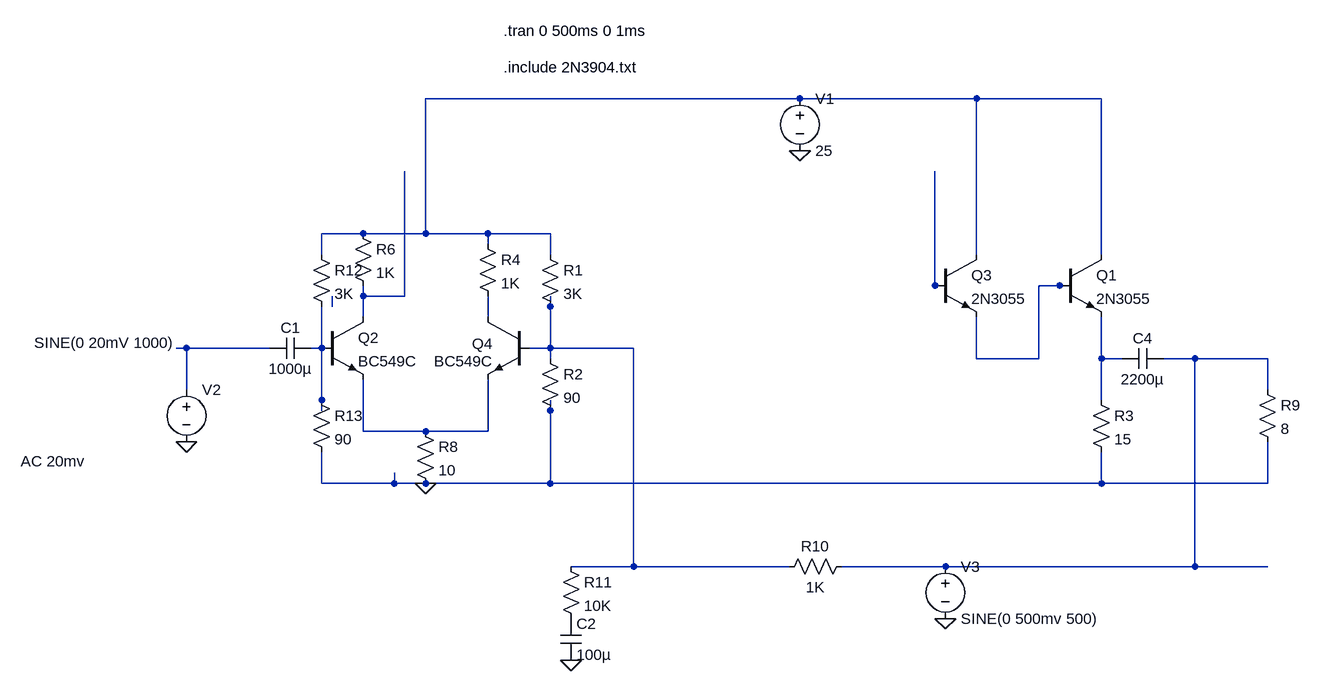
[diagram p0: schematic Long tailed with 2N3904 and cascaded common collectors - noise is completely removed.asc]
Long tailed with 2N3904 and cascaded common collectors - noise is completely removed.asc, the LTspice schematic file:
Version 4
SHEET 1 1032 680
WIRE -4896 -3424 -5472 -3424
WIRE -4624 -3424 -4896 -3424
WIRE -4432 -3424 -4624 -3424
WIRE -5568 -3216 -5632 -3216
WIRE -5472 -3216 -5472 -3424
WIRE -5472 -3216 -5568 -3216
WIRE -5376 -3216 -5472 -3216
WIRE -5280 -3216 -5376 -3216
WIRE -5376 -3200 -5376 -3216
WIRE -5632 -3184 -5632 -3216
WIRE -5280 -3184 -5280 -3216
WIRE -4624 -3184 -4624 -3424
WIRE -4432 -3184 -4432 -3424
WIRE -4688 -3136 -4688 -3312
WIRE -4672 -3136 -4688 -3136
WIRE -4496 -3136 -4528 -3136
WIRE -4480 -3136 -4496 -3136
WIRE -5568 -3120 -5568 -3136
WIRE -5504 -3120 -5504 -3312
WIRE -5504 -3120 -5568 -3120
WIRE -5616 -3104 -5616 -3120
WIRE -5280 -3104 -5280 -3120
WIRE -5568 -3088 -5568 -3120
WIRE -5376 -3088 -5376 -3120
WIRE -5840 -3040 -5856 -3040
WIRE -5712 -3040 -5840 -3040
WIRE -5632 -3040 -5632 -3104
WIRE -5632 -3040 -5648 -3040
WIRE -5280 -3040 -5280 -3104
WIRE -5280 -3040 -5312 -3040
WIRE -5152 -3040 -5280 -3040
WIRE -5280 -3024 -5280 -3040
WIRE -4624 -3024 -4624 -3088
WIRE -4528 -3024 -4528 -3136
WIRE -4528 -3024 -4624 -3024
WIRE -4432 -3024 -4432 -3088
WIRE -4400 -3024 -4432 -3024
WIRE -4288 -3024 -4336 -3024
WIRE -4176 -3024 -4288 -3024
WIRE -5840 -2976 -5840 -3040
WIRE -4176 -2976 -4176 -3024
WIRE -5632 -2960 -5632 -3040
WIRE -4432 -2960 -4432 -3024
WIRE -5632 -2944 -5632 -2960
WIRE -5280 -2944 -5280 -2960
WIRE -5568 -2912 -5568 -2992
WIRE -5472 -2912 -5568 -2912
WIRE -5376 -2912 -5376 -2992
WIRE -5376 -2912 -5472 -2912
WIRE -5632 -2832 -5632 -2880
WIRE -5520 -2832 -5520 -2848
WIRE -5520 -2832 -5632 -2832
WIRE -5472 -2832 -5520 -2832
WIRE -5280 -2832 -5280 -2944
WIRE -5280 -2832 -5472 -2832
WIRE -4432 -2832 -4432 -2880
WIRE -4432 -2832 -5280 -2832
WIRE -4176 -2832 -4176 -2896
WIRE -4176 -2832 -4432 -2832
WIRE -5152 -2704 -5152 -3040
WIRE -5152 -2704 -5248 -2704
WIRE -4912 -2704 -5152 -2704
WIRE -4672 -2704 -4832 -2704
WIRE -4288 -2704 -4288 -3024
WIRE -4288 -2704 -4672 -2704
WIRE -4176 -2704 -4288 -2704
FLAG -4896 -3344 0
FLAG -5840 -2896 0
FLAG -5472 -2832 0
FLAG -5248 -2560 0
FLAG -4672 -2624 0
SYMBOL voltage -4896 -3440 R0
WINDOW 123 0 0 Left 2
WINDOW 39 0 0 Left 2
SYMATTR InstName V1
SYMATTR Value 25
SYMBOL voltage -5840 -2992 R0
WINDOW 123 -255 126 Left 2
WINDOW 39 0 0 Left 2
WINDOW 3 -234 -56 Left 2
SYMATTR Value2 AC 20mv
SYMATTR Value SINE(0 20mV 1000)
SYMATTR InstName V2
SYMBOL npn2 -4688 -3184 R0
SYMATTR InstName Q3
SYMATTR Value 2N3055
SYMBOL cap -5648 -3056 R90
WINDOW 0 0 32 VBottom 2
WINDOW 3 32 32 VTop 2
SYMATTR InstName C1
SYMATTR Value 1000µ
SYMBOL res -4192 -2992 R0
SYMATTR InstName R9
SYMATTR Value 8
SYMBOL cap -4336 -3040 R90
WINDOW 0 0 32 VBottom 2
WINDOW 3 32 32 VTop 2
SYMATTR InstName C4
SYMATTR Value 2200µ
SYMBOL npn -5632 -3088 R0
SYMATTR InstName Q2
SYMATTR Value BC549C
SYMBOL npn -5312 -3088 M0
WINDOW 0 56 41 Left 2
SYMATTR InstName Q4
SYMATTR Value BC549C
SYMBOL res -5584 -3232 R0
SYMATTR InstName R6
SYMATTR Value 1K
SYMBOL res -5488 -2928 R0
SYMATTR InstName R8
SYMATTR Value 10
SYMBOL res -4816 -2720 R90
WINDOW 0 0 56 VBottom 2
WINDOW 3 32 56 VTop 2
SYMATTR InstName R10
SYMATTR Value 1K
SYMBOL res -5264 -2720 R0
SYMATTR InstName R11
SYMATTR Value 10K
SYMBOL res -5648 -3200 R0
SYMATTR InstName R12
SYMATTR Value 3K
SYMBOL res -5648 -2976 R0
SYMATTR InstName R13
SYMATTR Value 90
SYMBOL res -5296 -3200 R0
SYMATTR InstName R1
SYMATTR Value 3K
SYMBOL res -5296 -3040 R0
SYMATTR InstName R2
SYMATTR Value 90
SYMBOL npn2 -4496 -3184 R0
SYMATTR InstName Q1
SYMATTR Value 2N3055
SYMBOL res -4448 -2976 R0
SYMATTR InstName R3
SYMATTR Value 15
SYMBOL cap -5264 -2624 R0
SYMATTR InstName C2
SYMATTR Value 100µ
SYMBOL res -5392 -3216 R0
SYMATTR InstName R4
SYMATTR Value 1K
SYMBOL voltage -4672 -2720 R0
WINDOW 123 0 0 Left 2
WINDOW 39 0 0 Left 2
SYMATTR InstName V3
SYMATTR Value SINE(0 500mv 500)
TEXT -5352 -3528 Left 2 !.tran 0 500ms 0 1ms
TEXT -5352 -3472 Left 2 !.include 2N3904.txt

The netlist it stands for:
* Long tailed with 2N3904 and cascaded common collectors - noise is completely removed.asc
V1 N001 0 25
V2 N008 0 SINE(0 20mV 1000) AC 20mv
Q3 N001 N002 N003 0 2N3055
C1 N009 N008 1000µ
R9 N011 0 8
C4 N011 N010 2200µ
Q2 N004 N009 N012 0 BC549C
Q4 N007 N006 N012 0 BC549C
R6 N001 N004 1K
R8 N012 0 10
R10 N011 N006 1K
R11 N006 P001 10K
R12 N001 N009 3K
R13 N009 0 90
R1 N001 N006 3K
R2 N006 0 90
Q1 N001 N003 N010 0 2N3055
R3 N010 0 15
C2 P001 0 100µ
R4 N001 N007 1K
V3 N011 0 SINE(0 500mv 500)
.model NPN NPN
.model PNP PNP
.lib standard.bjt
.tran 0 500ms 0 1ms
.include 2N3904.txt
.backanno
.end